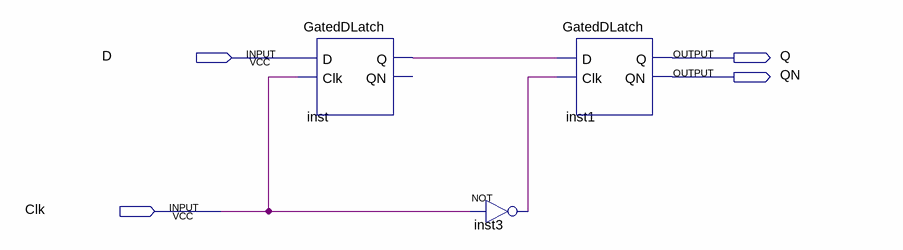
[diagram p0: schematic sheet]
// Quartus schematic NEDflipFlop.bdf as structural Verilog: 3 symbols, 4 pins
module NEDflipFlop (
  input  D,
  input  Clk,
  output Q,
  output QN
);

  wire inst3_out, inst_q;

  GatedDLatch inst (.D(D), .Clk(Clk), .Q(inst_q));  // open: QN
  not inst3 (inst3_out, Clk);
  GatedDLatch inst1 (.D(inst_q), .Clk(inst3_out), .Q(Q), .QN(QN));
endmodule
